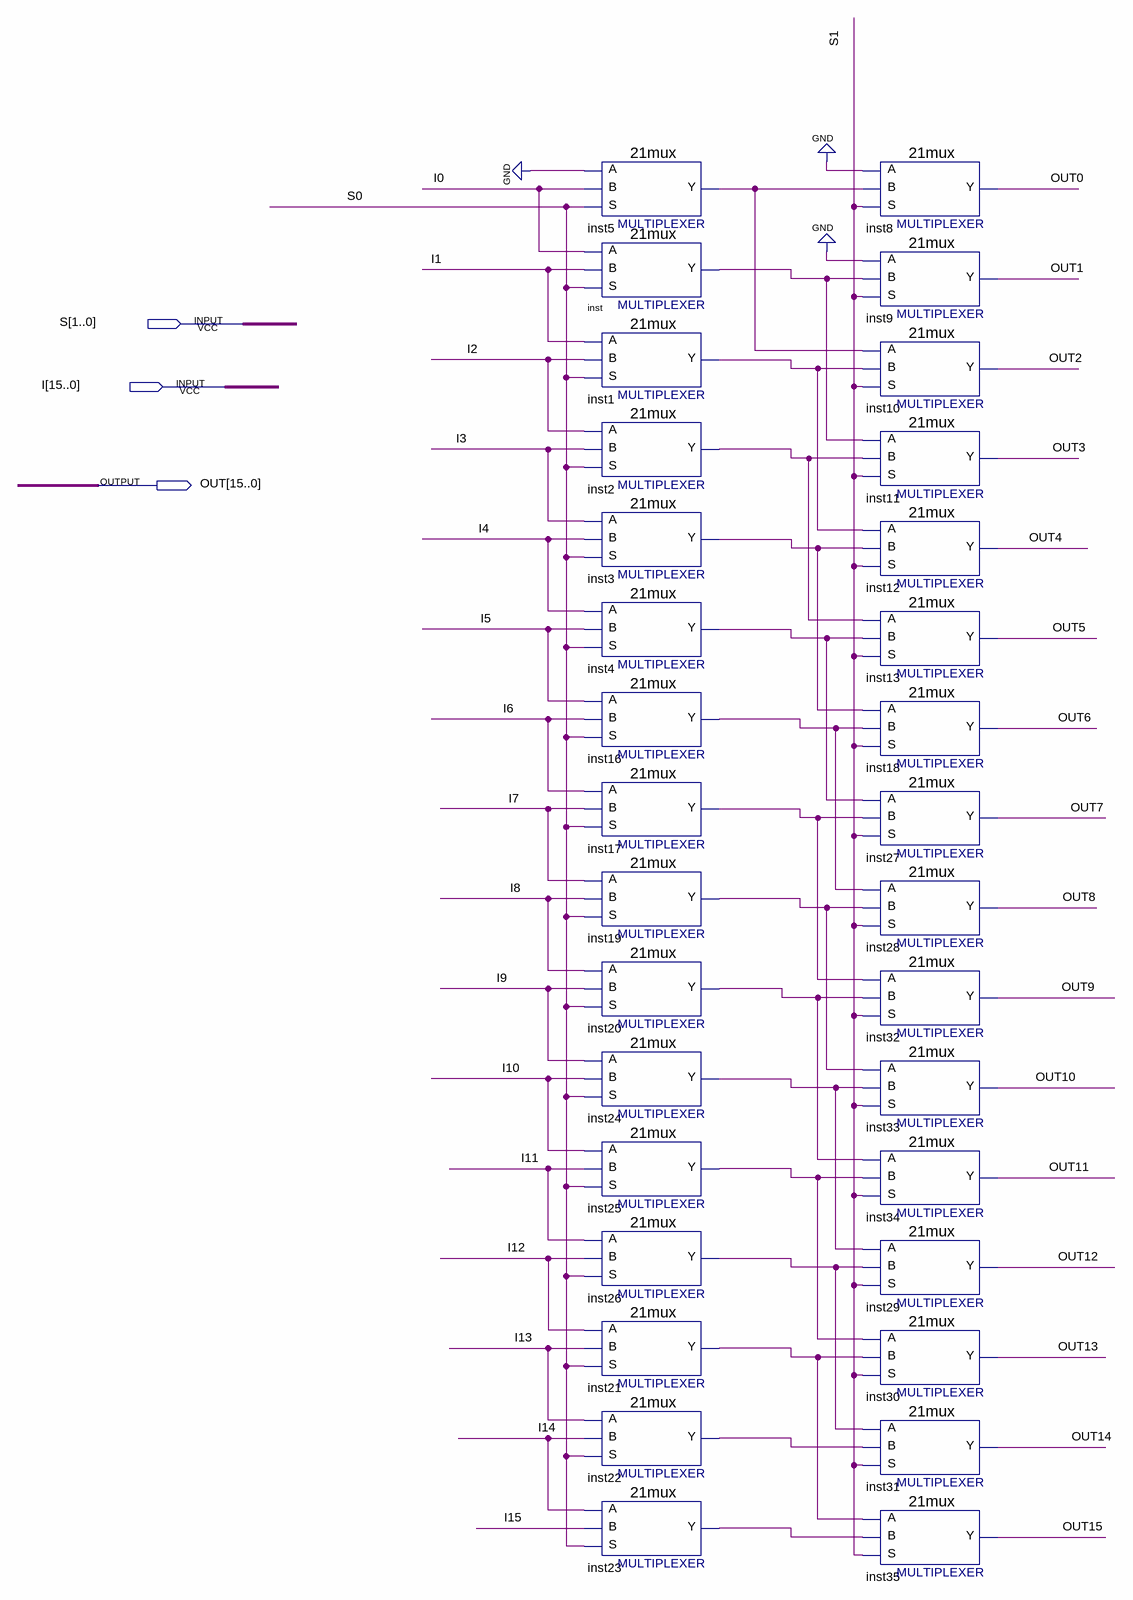
[diagram p0: schematic sheet]
// Quartus schematic shilftleft.bdf as structural Verilog: 32 symbols, 3 pins
module shilftleft (
  input  [1:0] S,
  input  [15:0] I,
  output [15:0] OUT
);

  wire inst1_y, inst2_y, inst3_y, inst4_y, inst5_y, inst16_y, inst17_y, inst19_y, inst20_y, inst21_y,
       inst22_y, inst23_y, inst24_y, inst25_y, inst26_y, inst_y;

  \21mux  inst5 (.S(S[0]), .B(I[0]), .A(1'b0), .Y(inst5_y));
  \21mux  inst (.S(S[0]), .B(I[1]), .A(I[0]), .Y(inst_y));
  \21mux  inst1 (.S(S[0]), .B(I[2]), .A(I[1]), .Y(inst1_y));
  \21mux  inst2 (.S(S[0]), .B(I[3]), .A(I[2]), .Y(inst2_y));
  \21mux  inst3 (.S(S[0]), .B(I[4]), .A(I[3]), .Y(inst3_y));
  \21mux  inst4 (.S(S[0]), .B(I[5]), .A(I[4]), .Y(inst4_y));
  \21mux  inst16 (.S(S[0]), .B(I[6]), .A(I[5]), .Y(inst16_y));
  \21mux  inst17 (.S(S[0]), .B(I[7]), .A(I[6]), .Y(inst17_y));
  \21mux  inst19 (.S(S[0]), .B(I[8]), .A(I[7]), .Y(inst19_y));
  \21mux  inst20 (.S(S[0]), .B(I[9]), .A(I[8]), .Y(inst20_y));
  \21mux  inst24 (.S(S[0]), .B(I[10]), .A(I[9]), .Y(inst24_y));
  \21mux  inst25 (.S(S[0]), .B(I[11]), .A(I[10]), .Y(inst25_y));
  \21mux  inst26 (.S(S[0]), .B(I[12]), .A(I[11]), .Y(inst26_y));
  \21mux  inst21 (.S(S[0]), .B(I[13]), .A(I[12]), .Y(inst21_y));
  \21mux  inst22 (.S(S[0]), .B(I[14]), .A(I[13]), .Y(inst22_y));
  \21mux  inst23 (.S(S[0]), .B(I[15]), .A(I[14]), .Y(inst23_y));
  \21mux  inst8 (.S(S[1]), .B(inst5_y), .A(1'b0), .Y(OUT[0]));
  \21mux  inst9 (.S(S[1]), .B(inst_y), .A(1'b0), .Y(OUT[1]));
  \21mux  inst10 (.S(S[1]), .B(inst1_y), .A(inst5_y), .Y(OUT[2]));
  \21mux  inst11 (.S(S[1]), .B(inst2_y), .A(inst_y), .Y(OUT[3]));
  \21mux  inst12 (.S(S[1]), .B(inst3_y), .A(inst1_y), .Y(OUT[4]));
  \21mux  inst13 (.S(S[1]), .B(inst4_y), .A(inst2_y), .Y(OUT[5]));
  \21mux  inst18 (.S(S[1]), .B(inst16_y), .A(inst3_y), .Y(OUT[6]));
  \21mux  inst27 (.S(S[1]), .B(inst17_y), .A(inst4_y), .Y(OUT[7]));
  \21mux  inst28 (.S(S[1]), .B(inst19_y), .A(inst16_y), .Y(OUT[8]));
  \21mux  inst32 (.S(S[1]), .B(inst20_y), .A(inst17_y), .Y(OUT[9]));
  \21mux  inst33 (.S(S[1]), .B(inst24_y), .A(inst19_y), .Y(OUT[10]));
  \21mux  inst34 (.S(S[1]), .B(inst25_y), .A(inst20_y), .Y(OUT[11]));
  \21mux  inst29 (.S(S[1]), .B(inst26_y), .A(inst24_y), .Y(OUT[12]));
  \21mux  inst30 (.S(S[1]), .B(inst21_y), .A(inst25_y), .Y(OUT[13]));
  \21mux  inst31 (.S(S[1]), .B(inst22_y), .A(inst26_y), .Y(OUT[14]));
  \21mux  inst35 (.S(S[1]), .B(inst23_y), .A(inst21_y), .Y(OUT[15]));
endmodule
